# Altium schematic sheet Motor Driver.SchDoc
size A4; SheetNumber: 2; SheetTotal: 2
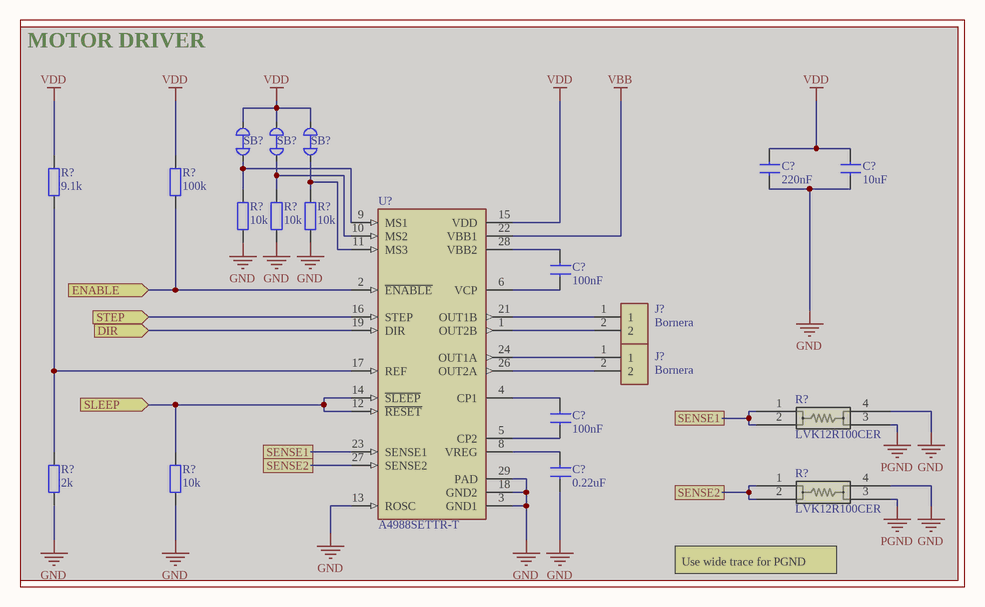
[diagram p0: Motor Driver.SchDoc]

## Parts
(Parts that share a designator on the sheet are numbered #1, #2 ... from top to bottom, then left to right.)
C?#1  220nF  [RES_0805]  (masked out: inside a compile mask, not in the netlist)
C?#2  10uF  [RES_0805]  (masked out: inside a compile mask, not in the netlist)
C?#3  100nF  [RES_0805]  (masked out: inside a compile mask, not in the netlist)
C?#4  100nF  [RES_0805]  (masked out: inside a compile mask, not in the netlist)
C?#5  0.22uF  [RES_0805]  (masked out: inside a compile mask, not in the netlist)
J?#1  Bornera  [CUI_TB002-500-02BE]  (masked out: inside a compile mask, not in the netlist)
J?#2  Bornera  [CUI_TB002-500-02BE]  (masked out: inside a compile mask, not in the netlist)
R?#1  9.1k  [RES_0805]  (masked out: inside a compile mask, not in the netlist)
R?#2  100k  [RES_0805]  (masked out: inside a compile mask, not in the netlist)
R?#3  10k  [RES_0805]  (masked out: inside a compile mask, not in the netlist)
R?#4  10k  [RES_0805]  (masked out: inside a compile mask, not in the netlist)
R?#5  10k  [RES_0805]  (masked out: inside a compile mask, not in the netlist)
R?#6  LVK12R100CER  [LVK12_OHM-m]  (masked out: inside a compile mask, not in the netlist)
R?#7  2k  [RES_0805]  (masked out: inside a compile mask, not in the netlist)
R?#8  10k  [RES_0805]  (masked out: inside a compile mask, not in the netlist)
R?#9  LVK12R100CER  [LVK12_OHM-m]  (masked out: inside a compile mask, not in the netlist)
SB?#1  SolderBridge_Short  [SolderBridge_Short]  (value not drawn)  (masked out: inside a compile mask, not in the netlist)
SB?#2  SolderBridge_Short  [SolderBridge_Short]  (value not drawn)  (masked out: inside a compile mask, not in the netlist)
SB?#3  SolderBridge_Short  [SolderBridge_Short]  (value not drawn)  (masked out: inside a compile mask, not in the netlist)
U?  A4988SETTR-T  [QFN50P500X500X90-29N]  (masked out: inside a compile mask, not in the netlist)

## Blocks framed on the sheet
MOTOR DRIVER: C?#1-C?#5 J?#1 J?#2 R?#1-R?#9 SB?#1-SB?#3 U?

## Ports
DIR (in, see Main[1A], Microcontroller[2C]), ENABLE (in, see Main[1A]), SLEEP (in, see Main[1A]), STEP (in, see Main[1B], Microcontroller[2B])

## Notes on the sheet
- (near R?#9) Use wide trace for PGND

## Library data of the parts
C?#1-C?#5 = CAP_0805: Generic Capacitor
J?#1 J?#2 = 2PBorn-TB002-500-02BE: 2~24 Poles, Screw Type, Horizontal, 5.0 Pitch, 22~12 (AWG), Terminal Block Connector; MF: Same Sky; SnapEDA_Link: https://www.snapeda.com/parts/TB002-500-02BE/Same+Sky/view-part/?ref=snap; Package: None; Value: *; MP: TB002-500-02BE; Check_prices: https://www.snapeda.com/parts/TB002-500-02BE/Same+Sky/view-part/?ref=eda
R?#1-R?#5 R?#7 R?#8 = RES_0805: Generic Capacitor
R?#6 R?#9 = R0_1-0_5W-LVK12R100CER: Description; Manufacturer_Name: Ohmite; Copyright: Copyright (C) 2025 Ultra Librarian. All rights reserved.; Manufacturer_Part_Number: LVK12R100CER; RefDes: RefDes; Type: Type
U? = A4988SETTR-T: DMOS Microstepping Driver with Translator And Overcurrent Protection; MF: Allegro; SnapEDA_Link: https://www.snapeda.com/parts/A4988SETTR-T/Allegro/view-part/?ref=snap; Package: QFN-28 Allegro MicroSystems LLC; Value: *; MP: A4988SETTR-T; Check_prices: https://www.snapeda.com/parts/A4988SETTR-T/Allegro/view-part/?ref=eda